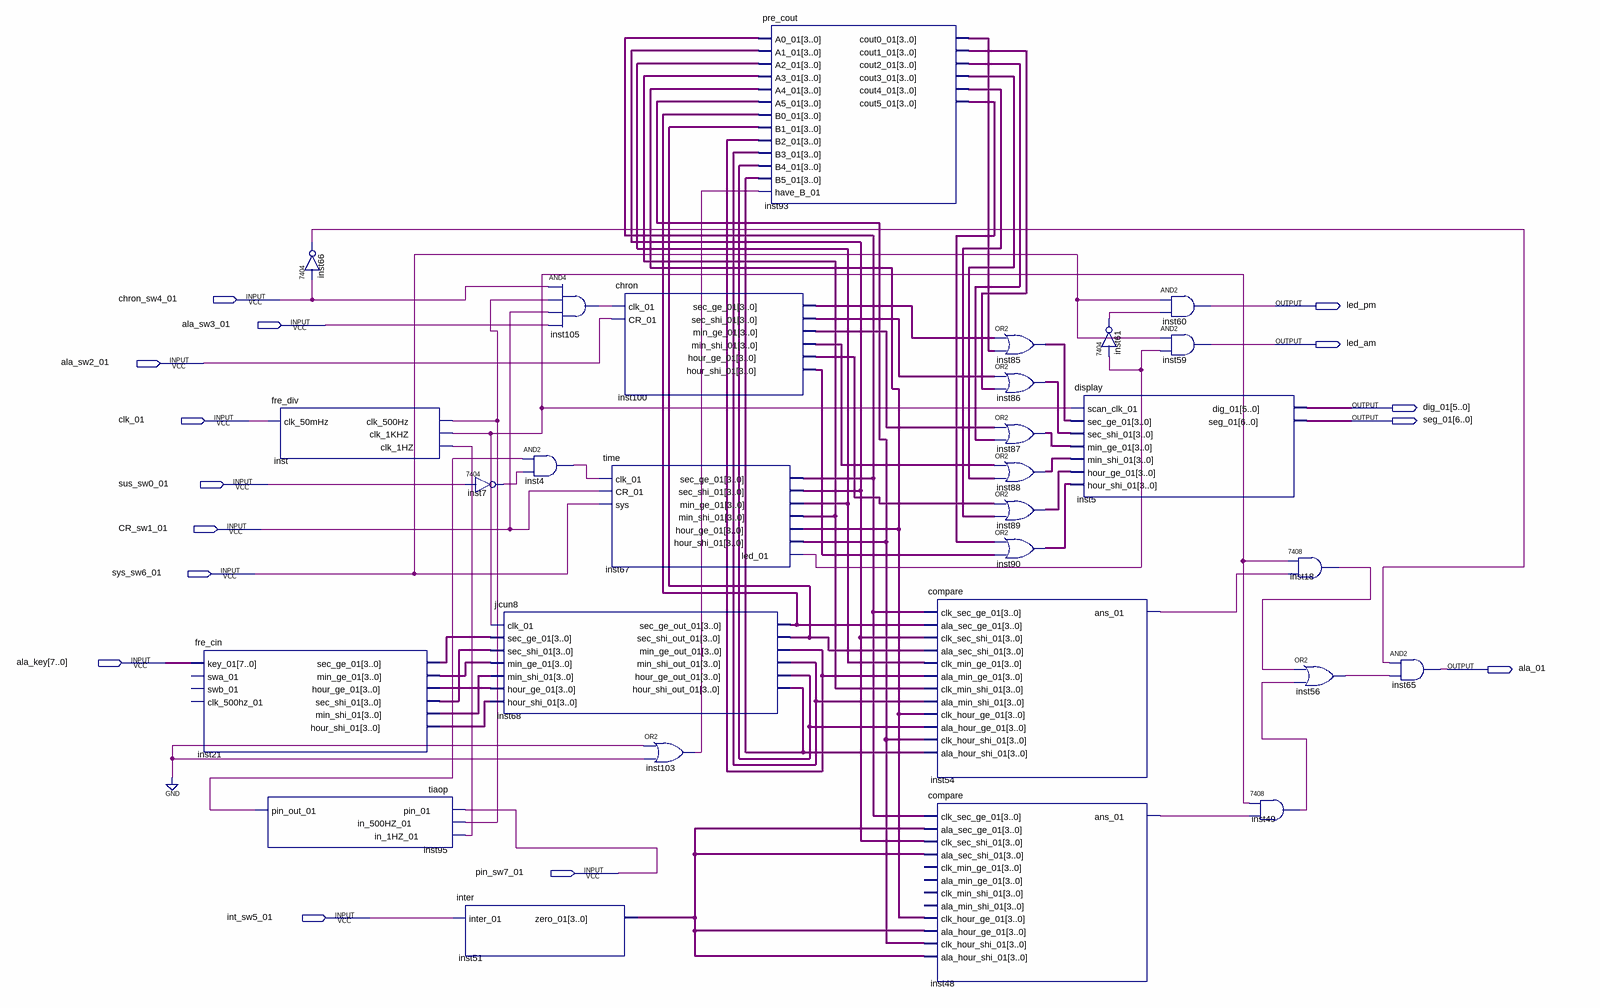
[diagram p0: schematic sheet]
// Quartus schematic Top_level.bdf as structural Verilog: 29 symbols, 15 pins
module Top_level (
  input  chron_sw4_01,
  input  ala_sw3_01,
  input  ala_sw2_01,
  input  clk_01,
  input  sus_sw0_01,
  input  CR_sw1_01,
  input  sys_sw6_01,
  input  [7:0] ala_key,
  input  pin_sw7_01,
  input  int_sw5_01,
  output led_pm,
  output led_am,
  output [5:0] dig_01,
  output [6:0] seg_01,
  output ala_01
);

  wire inst4_out, inst7_1, inst18_1, inst48_ans_01, inst49_1, inst54_ans_01, inst56_out, inst61_1, inst66_1,
       inst67_led_01, inst95_pin_out_01, inst103_out, inst105_out, inst_clk_1hz, inst_clk_1khz,
       inst_clk_500hz;
  wire [3:0] inst21_hour_ge_01, inst21_hour_shi_01, inst21_min_ge_01, inst21_min_shi_01, inst21_sec_ge_01,
       inst21_sec_shi_01, inst51_zero_01, inst67_hour_ge_01, inst67_hour_shi_01, inst67_min_ge_01,
       inst67_min_shi_01, inst67_sec_ge_01, inst67_sec_shi_01, inst68_hour_ge_out_01, inst68_hour_shi_out_01,
       inst68_min_ge_out_01, inst68_min_shi_out_01, inst68_sec_ge_out_01, inst68_sec_shi_out_01, inst85_out,
       inst86_out, inst87_out, inst88_out, inst89_out, inst90_out, inst93_cout0_01, inst93_cout1_01,
       inst93_cout2_01, inst93_cout3_01, inst93_cout4_01, inst93_cout5_01, inst100_hour_ge_01,
       inst100_hour_shi_01, inst100_min_ge_01, inst100_min_shi_01, inst100_sec_ge_01, inst100_sec_shi_01;

  fre_cin inst21 (
    .key_01(ala_key), .sec_ge_01(inst21_sec_ge_01), .min_ge_01(inst21_min_ge_01),
    .hour_ge_01(inst21_hour_ge_01), .sec_shi_01(inst21_sec_shi_01), .min_shi_01(inst21_min_shi_01),
    .hour_shi_01(inst21_hour_shi_01));  // open: swa_01, swb_01, clk_500hz_01
  fre_div inst (.clk_50mHz(clk_01), .clk_500Hz(inst_clk_500hz), .clk_1KHZ(inst_clk_1khz), .clk_1HZ(inst_clk_1hz));
  tiaop inst95 (
    .pin_01(pin_sw7_01), .in_500HZ_01(inst_clk_500hz), .in_1HZ_01(inst_clk_1hz),
    .pin_out_01(inst95_pin_out_01));
  \7404  inst66 (.\2 (chron_sw4_01), .\1 (inst66_1));
  \7404  inst7 (.\2 (sus_sw0_01), .\1 (inst7_1));
  inter inst51 (.inter_01(int_sw5_01), .zero_01(inst51_zero_01));
  and inst4 (inst4_out, inst95_pin_out_01, inst7_1);
  jicun8 inst68 (
    .clk_01(inst_clk_1khz), .sec_ge_01(inst21_sec_ge_01), .sec_shi_01(inst21_sec_shi_01),
    .min_ge_01(inst21_min_ge_01), .min_shi_01(inst21_min_shi_01), .hour_ge_01(inst21_hour_ge_01),
    .hour_shi_01(inst21_hour_shi_01), .sec_ge_out_01(inst68_sec_ge_out_01),
    .sec_shi_out_01(inst68_sec_shi_out_01), .min_ge_out_01(inst68_min_ge_out_01),
    .min_shi_out_01(inst68_min_shi_out_01), .hour_ge_out_01(inst68_hour_ge_out_01),
    .hour_shi_out_01(inst68_hour_shi_out_01));
  and inst105 (inst105_out, chron_sw4_01, inst_clk_500hz, CR_sw1_01, ala_sw3_01);
  chron inst100 (
    .clk_01(inst105_out), .CR_01(ala_sw2_01), .sec_ge_01(inst100_sec_ge_01), .sec_shi_01(inst100_sec_shi_01),
    .min_ge_01(inst100_min_ge_01), .min_shi_01(inst100_min_shi_01), .hour_ge_01(inst100_hour_ge_01),
    .hour_shi_01(inst100_hour_shi_01));
  \time  inst67 (
    .clk_01(inst4_out), .CR_01(CR_sw1_01), .sys(sys_sw6_01), .sec_ge_01(inst67_sec_ge_01),
    .sec_shi_01(inst67_sec_shi_01), .min_ge_01(inst67_min_ge_01), .min_shi_01(inst67_min_shi_01),
    .hour_ge_01(inst67_hour_ge_01), .hour_shi_01(inst67_hour_shi_01), .led_01(inst67_led_01));
  or inst103 (inst103_out, 1'b0, 1'b0);
  pre_cout inst93 (
    .A0_01(inst67_sec_ge_01), .A1_01(inst67_sec_shi_01), .A2_01(inst67_min_ge_01), .A3_01(inst67_min_shi_01),
    .A4_01(inst67_hour_ge_01), .A5_01(inst67_hour_shi_01), .B0_01(inst68_sec_ge_out_01),
    .B1_01(inst68_sec_shi_out_01), .B2_01(inst68_min_ge_out_01), .B3_01(inst68_min_shi_out_01),
    .B4_01(inst68_hour_ge_out_01), .B5_01(inst68_hour_shi_out_01), .have_B_01(inst103_out),
    .cout0_01(inst93_cout0_01), .cout1_01(inst93_cout1_01), .cout2_01(inst93_cout2_01),
    .cout3_01(inst93_cout3_01), .cout4_01(inst93_cout4_01), .cout5_01(inst93_cout5_01));
  compare inst54 (
    .clk_sec_ge_01(inst67_sec_ge_01), .ala_sec_ge_01(inst68_sec_ge_out_01),
    .clk_sec_shi_01(inst67_sec_shi_01), .ala_sec_shi_01(inst68_sec_shi_out_01),
    .clk_min_ge_01(inst67_min_ge_01), .ala_min_ge_01(inst68_min_ge_out_01),
    .clk_min_shi_01(inst67_min_shi_01), .ala_min_shi_01(inst68_min_shi_out_01),
    .clk_hour_ge_01(inst67_hour_ge_01), .ala_hour_ge_01(inst68_hour_ge_out_01),
    .clk_hour_shi_01(inst67_hour_shi_01), .ala_hour_shi_01(inst68_hour_shi_out_01), .ans_01(inst54_ans_01));
  compare inst48 (
    .clk_sec_ge_01(inst67_sec_ge_01), .ala_sec_ge_01(inst51_zero_01), .clk_sec_shi_01(inst67_sec_shi_01),
    .ala_sec_shi_01(inst51_zero_01), .clk_hour_ge_01(inst67_hour_ge_01), .ala_hour_ge_01(inst51_zero_01),
    .clk_hour_shi_01(inst67_hour_shi_01), .ala_hour_shi_01(inst51_zero_01), .ans_01(inst48_ans_01));  // open: clk_min_ge_01, ala_min_ge_01, clk_min_shi_01, ala_min_shi_01
  assign inst85_out = inst100_sec_ge_01 | inst93_cout0_01;  // OR2 inst85, 4 bits wide
  assign inst86_out = inst100_sec_shi_01 | inst93_cout1_01;  // OR2 inst86, 4 bits wide
  assign inst87_out = inst100_min_ge_01 | inst93_cout2_01;  // OR2 inst87, 4 bits wide
  assign inst88_out = inst100_min_shi_01 | inst93_cout3_01;  // OR2 inst88, 4 bits wide
  assign inst89_out = inst100_hour_ge_01 | inst93_cout4_01;  // OR2 inst89, 4 bits wide
  assign inst90_out = inst93_cout5_01 | inst100_hour_shi_01;  // OR2 inst90, 4 bits wide
  display inst5 (
    .scan_clk_01(inst_clk_1khz), .sec_ge_01(inst85_out), .sec_shi_01(inst86_out), .min_ge_01(inst87_out),
    .min_shi_01(inst88_out), .hour_ge_01(inst89_out), .hour_shi_01(inst90_out), .dig_01(dig_01),
    .seg_01(seg_01));
  \7404  inst61 (.\2 (inst67_led_01), .\1 (inst61_1));
  and inst60 (led_pm, sys_sw6_01, inst61_1);
  and inst59 (led_am, sys_sw6_01, inst67_led_01);
  \7408  inst18 (.\3 (inst54_ans_01), .\2 (inst_clk_1khz), .\1 (inst18_1));
  or inst56 (inst56_out, inst18_1, inst49_1);
  \7408  inst49 (.\3 (inst48_ans_01), .\2 (inst_clk_1khz), .\1 (inst49_1));
  and inst65 (ala_01, inst66_1, inst56_out);
endmodule
